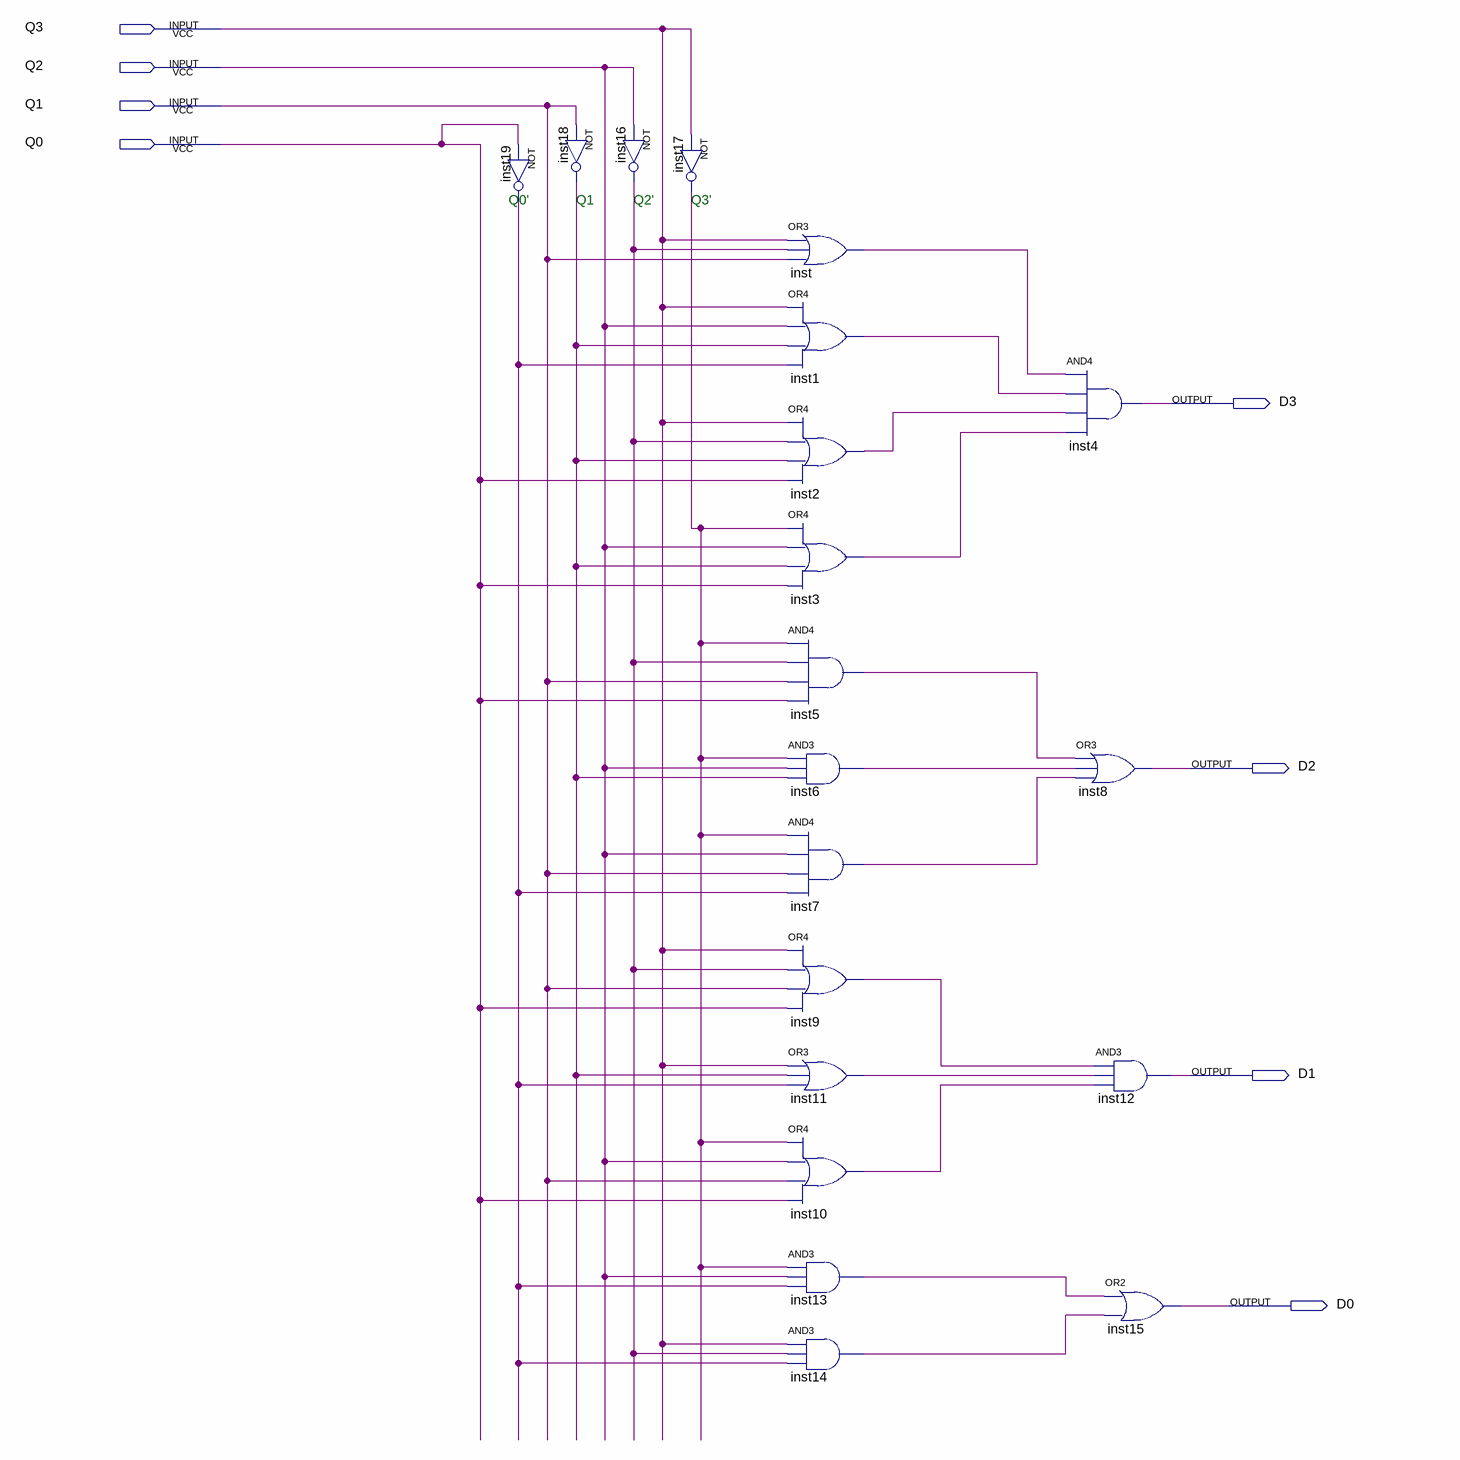
[diagram p0: schematic sheet]
// Quartus schematic Schematic1_MachChuyendoi.bdf as structural Verilog: 20 symbols, 8 pins
module Schematic1_MachChuyendoi (
  input  Q3,
  input  Q2,
  input  Q1,
  input  Q0,
  output D3,
  output D2,
  output D1,
  output D0
);

  wire inst1_out, inst2_out, inst3_out, inst5_out, inst6_out, inst7_out, inst9_out, inst10_out, inst11_out,
       inst13_out, inst14_out, inst16_out, inst17_out, inst18_out, inst19_out, inst_out;

  not inst19 (inst19_out, Q0);
  not inst18 (inst18_out, Q1);
  not inst16 (inst16_out, Q2);
  not inst17 (inst17_out, Q3);
  or inst (inst_out, Q3, inst16_out, Q1);
  or inst1 (inst1_out, Q3, Q2, inst18_out, inst19_out);
  or inst2 (inst2_out, Q3, inst16_out, inst18_out, Q0);
  or inst3 (inst3_out, inst17_out, Q2, inst18_out, Q0);
  and inst5 (inst5_out, inst17_out, inst16_out, Q1, Q0);
  and inst6 (inst6_out, inst17_out, Q2, inst18_out);
  and inst7 (inst7_out, inst17_out, Q2, Q1, inst19_out);
  or inst9 (inst9_out, Q3, inst16_out, Q1, Q0);
  or inst11 (inst11_out, Q3, inst18_out, inst19_out);
  or inst10 (inst10_out, inst17_out, Q2, Q1, Q0);
  and inst13 (inst13_out, inst17_out, Q2, inst19_out);
  and inst14 (inst14_out, Q3, inst16_out, inst19_out);
  and inst4 (D3, inst_out, inst1_out, inst2_out, inst3_out);
  or inst8 (D2, inst5_out, inst6_out, inst7_out);
  and inst12 (D1, inst9_out, inst11_out, inst10_out);
  or inst15 (D0, inst13_out, inst14_out);

  // Notes on the sheet:
  //   Q0'
  //   Q1
  //   Q2'
  //   Q3'
endmodule
